# EAGLE design CU (EAGLE 6.5.0)
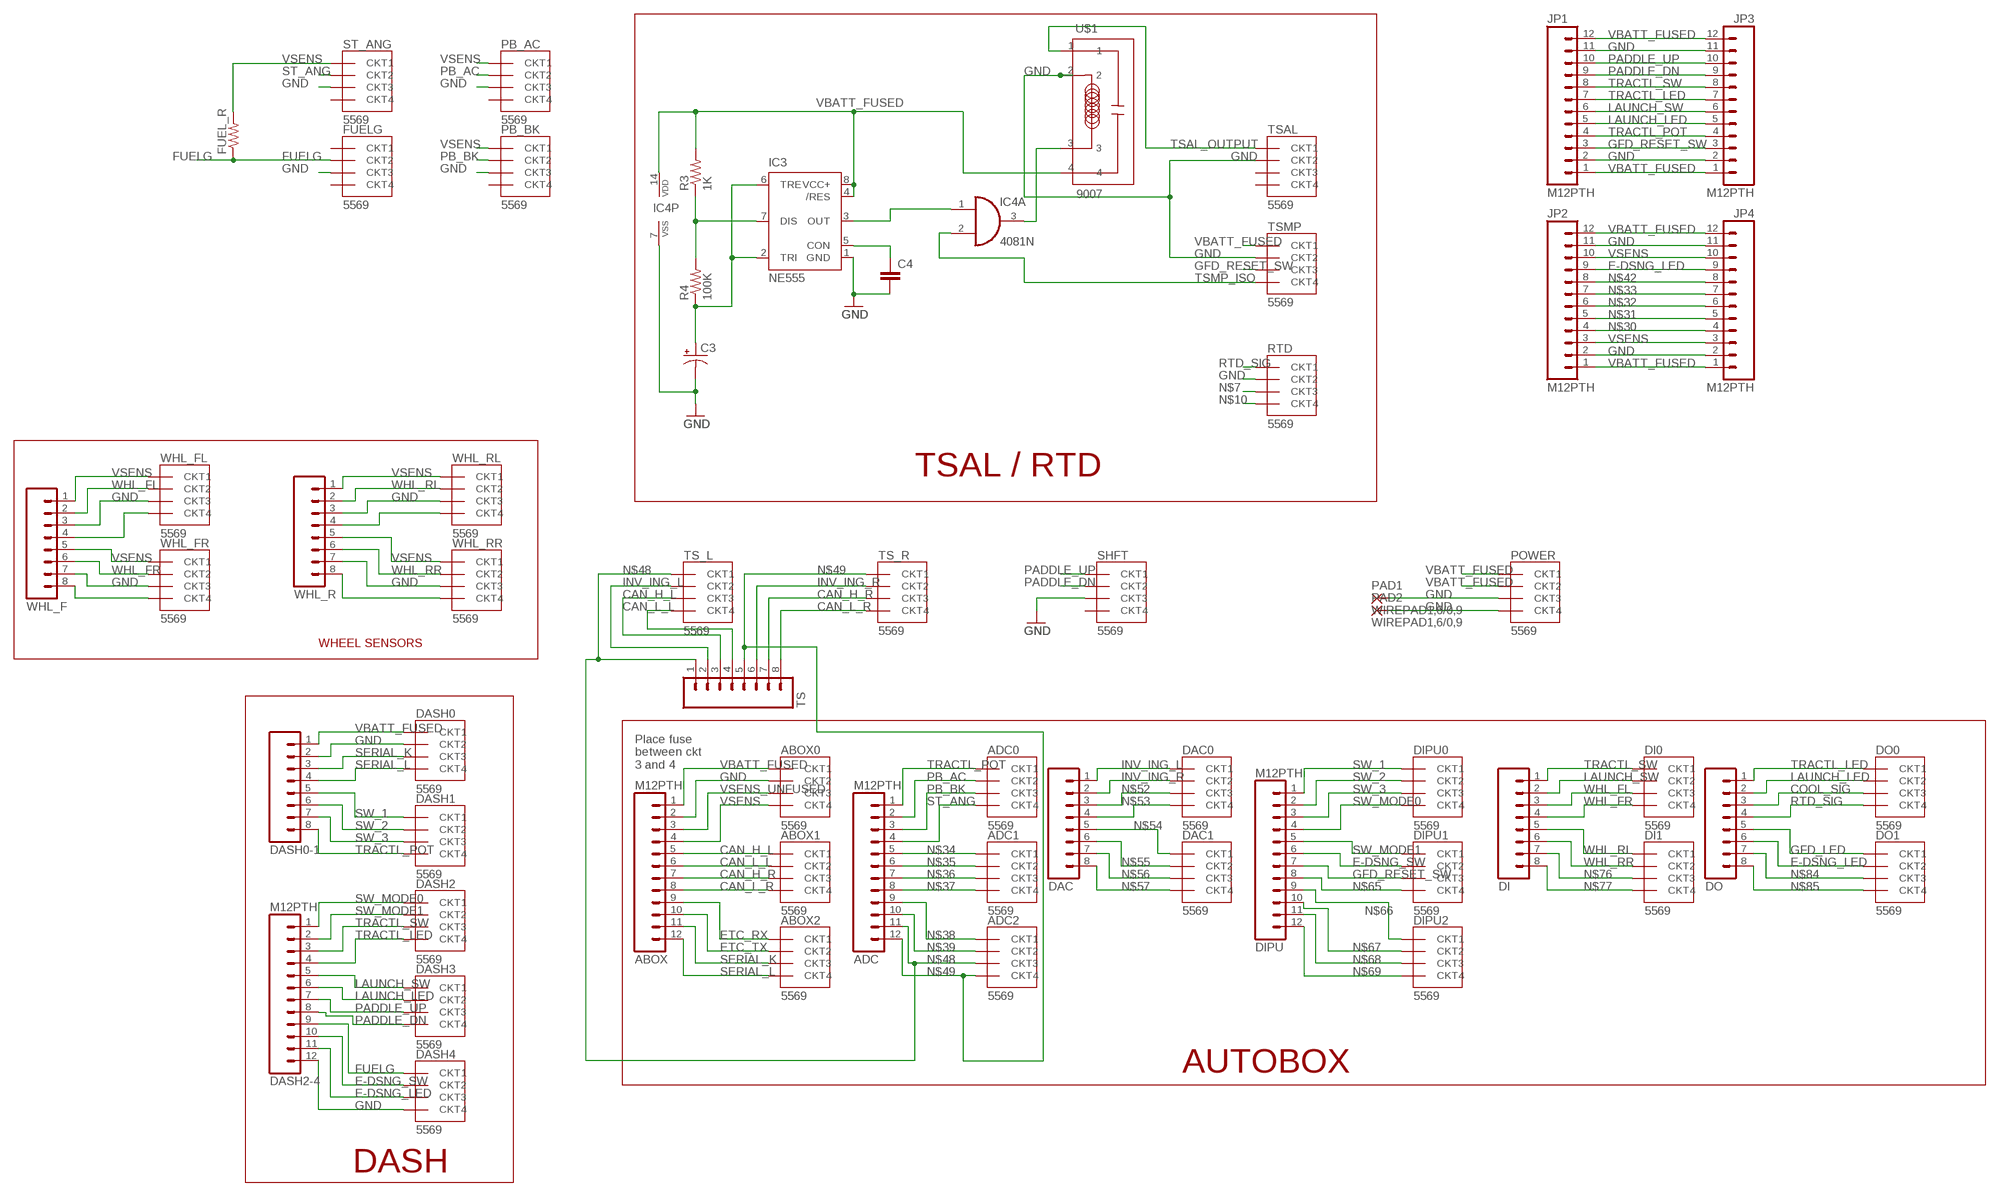
[diagram p0: schematic, sheet 1]

## Parts
ABOX  M12PTH  [1X12]
ABOX0  5569  [5569]
ABOX1  5569  [5569]
ABOX2  5569  [5569]
ADC  M12PTH  [1X12]
ADC0  5569  [5569]
ADC1  5569  [5569]
ADC2  5569  [5569]
C3  CAP_POLPTH1  [CPOL-RADIAL-100UF-25V]
C4  CAPPTH2  [CAP-PTH-SMALL2]
DAC  M081X08  [1X08]
DAC0  5569  [5569]
DAC1  5569  [5569]
DASH0  5569  [5569]
DASH0-1  M081X08  [1X08]
DASH1  5569  [5569]
DASH2  5569  [5569]
DASH2-4  M12PTH  [1X12]
DASH3  5569  [5569]
DASH4  5569  [5569]
DI  M081X08  [1X08]
DI0  5569  [5569]
DI1  5569  [5569]
DIPU  M12PTH  [1X12]
DIPU0  5569  [5569]
DIPU1  5569  [5569]
DIPU2  5569  [5569]
DO  M081X08  [1X08]
DO0  5569  [5569]
DO1  5569  [5569]
FUEL_R  R-US_0204/7  [0204/7]
FUELG  5569  [5569]
IC3  NE555  [DIL-08]
IC4  4081N  [DIL14]
JP1  M12PTH  [1X12]
JP2  M12PTH  [1X12]
JP3  M12PTH  [1X12]
JP4  M12PTH  [1X12]
PAD1  WIREPAD1,6/0,9  [1,6/0,9]
PAD2  WIREPAD1,6/0,9  [1,6/0,9]
PB_AC  5569  [5569]
PB_BK  5569  [5569]
POWER  5569  [5569]
R3  1K  RESISTOREZ  [AXIAL-0.3EZ]
R4  100K  RESISTOREZ  [AXIAL-0.3EZ]
RTD  5569  [5569]
SHFT  5569  [5569]
ST_ANG  5569  [5569]
TS  M081X08  [1X08]
TS_L  5569  [5569]
TS_R  5569  [5569]
TSAL  5569  [5569]
TSMP  5569  [5569]
U$1  9007  [9007]
WHL_F  M081X08  [1X08]
WHL_FL  5569  [5569]
WHL_FR  5569  [5569]
WHL_R  M081X08  [1X08]
WHL_RL  5569  [5569]
WHL_RR  5569  [5569]

## Nets
CAN_H_L: ABOX1.CKT1 ABOX.5 TS.3 TS_L.CKT3
CAN_H_R: ABOX1.CKT3 ABOX.7 TS.7 TS_R.CKT3
CAN_L_L: ABOX1.CKT2 ABOX.6 TS.4 TS_L.CKT4
CAN_L_R: ABOX1.CKT4 ABOX.8 TS.8 TS_R.CKT4
COOL_SIG: DO0.CKT3 DO.3
E-DSNG_LED: DASH2-4.11 DASH4.CKT3 DO1.CKT2 DO.6 JP2.9 JP4.9
E-DSNG_SW: DASH2-4.10 DASH4.CKT2 DIPU1.CKT2 DIPU.6
ETC_RX: ABOX2.CKT1 ABOX.9
ETC_TX: ABOX2.CKT2 ABOX.10
FUELG: DASH2-4.9 DASH4.CKT1 FUEL_R.1 FUELG.CKT2
GFD_LED: DO1.CKT1 DO.5
GFD_RESET_SW: DIPU1.CKT3 DIPU.7 JP1.3 JP3.3 TSMP.CKT3
GND: ABOX0.CKT2 ABOX.2 C3.2(-) C4.2 DASH0-1.2 DASH0.CKT2 DASH2-4.12 DASH4.CKT4 FUELG.CKT3 IC3.1(GND) IC4.7(P:VSS) JP1.2 JP1.11 JP2.2 JP2.11 JP3.2 JP3.11 JP4.2 JP4.11 PAD1.1(P) PAD2.1(P) PB_AC.CKT3 PB_BK.CKT3 POWER.CKT3 POWER.CKT4 RTD.CKT2 SHFT.CKT3 ST_ANG.CKT3 TSAL.CKT2 TSMP.CKT2 U$1.2 WHL_F.3 WHL_F.7 WHL_FL.CKT3 WHL_FR.CKT3 WHL_R.3 WHL_R.7 WHL_RL.CKT3 WHL_RR.CKT3
INV_ING_L: DAC0.CKT1 DAC.1 TS.2 TS_L.CKT2
INV_ING_R: DAC0.CKT2 DAC.2 TS.6 TS_R.CKT2
LAUNCH_LED: DASH2-4.6 DASH3.CKT2 DO0.CKT2 DO.2 JP1.5 JP3.5
LAUNCH_SW: DASH2-4.5 DASH3.CKT1 DI0.CKT2 DI.2 JP1.6 JP3.6
N$4: WHL_F.4 WHL_FL.CKT4
N$7: RTD.CKT3
N$8: WHL_F.8 WHL_FR.CKT4
N$9: WHL_R.8 WHL_RR.CKT4
N$10: RTD.CKT4
N$12: IC3.3(OUT) IC4.1(A:I0)
N$13: WHL_R.4 WHL_RL.CKT4
N$14: IC4.3(A:O) U$1.3
N$22: IC3.7(DIS) R3.P$1 R4.P$2
N$23: C3.1(+) IC3.2(TRI) IC3.6(TRE) R4.P$1
N$24: C4.1 IC3.5(CON)
N$30: JP2.4 JP4.4
N$31: JP2.5 JP4.5
N$32: JP2.6 JP4.6
N$33: JP2.7 JP4.7
N$34: ADC1.CKT1 ADC.5
N$35: ADC1.CKT2 ADC.6
N$36: ADC1.CKT3 ADC.7
N$37: ADC1.CKT4 ADC.8
N$38: ADC2.CKT1 ADC.9
N$39: ADC2.CKT2 ADC.10
N$42: JP2.8 JP4.8
N$48: ADC2.CKT3 ADC.11 TS.1 TS_L.CKT1
N$49: ADC2.CKT4 ADC.12 TS.5 TS_R.CKT1
N$52: DAC0.CKT3 DAC.3
N$53: DAC0.CKT4 DAC.4
N$54: DAC1.CKT1 DAC.5
N$55: DAC1.CKT2 DAC.6
N$56: DAC1.CKT3 DAC.7
N$57: DAC1.CKT4 DAC.8
N$65: DIPU1.CKT4 DIPU.8
N$66: DIPU2.CKT1 DIPU.9
N$67: DIPU2.CKT2 DIPU.10
N$68: DIPU2.CKT3 DIPU.11
N$69: DIPU2.CKT4 DIPU.12
N$76: DI1.CKT3 DI.7
N$77: DI1.CKT4 DI.8
N$84: DO1.CKT3 DO.7
N$85: DO1.CKT4 DO.8
PADDLE_DN: DASH2-4.8 DASH3.CKT4 JP1.9 JP3.9 SHFT.CKT2
PADDLE_UP: DASH2-4.7 DASH3.CKT3 JP1.10 JP3.10 SHFT.CKT1
PB_AC: ADC0.CKT2 ADC.2 PB_AC.CKT2
PB_BK: ADC0.CKT3 ADC.3 PB_BK.CKT2
RTD_SIG: DO0.CKT4 DO.4 RTD.CKT1
SERIAL_K: ABOX2.CKT3 ABOX.11 DASH0-1.3 DASH0.CKT3
SERIAL_L: ABOX2.CKT4 ABOX.12 DASH0-1.4 DASH0.CKT4
ST_ANG: ADC0.CKT4 ADC.4 ST_ANG.CKT2
SW_1: DASH0-1.5 DASH1.CKT1 DIPU0.CKT1 DIPU.1
SW_2: DASH0-1.6 DASH1.CKT2 DIPU0.CKT2 DIPU.2
SW_3: DASH0-1.7 DASH1.CKT3 DIPU0.CKT3 DIPU.3
SW_MODE0: DASH2-4.1 DASH2.CKT1 DIPU0.CKT4 DIPU.4
SW_MODE1: DASH2-4.2 DASH2.CKT2 DIPU1.CKT1 DIPU.5
TRACTL_LED: DASH2-4.4 DASH2.CKT4 DO0.CKT1 DO.1 JP1.7 JP3.7
TRACTL_POT: ADC0.CKT1 ADC.1 DASH0-1.8 DASH1.CKT4 JP1.4 JP3.4
TRACTL_SW: DASH2-4.3 DASH2.CKT3 DI0.CKT1 DI.1 JP1.8 JP3.8
TSAL_OUTPUT: TSAL.CKT1 U$1.1
TSMP_ISO: IC4.2(A:I1) TSMP.CKT4
VBATT_FUSED: ABOX0.CKT1 ABOX.1 DASH0-1.1 DASH0.CKT1 IC3.4(/RES) IC3.8(VCC+) IC4.14(P:VDD) JP1.1 JP1.12 JP2.1 JP2.12 JP3.1 JP3.12 JP4.1 JP4.12 POWER.CKT1 POWER.CKT2 R3.P$2 TSMP.CKT1 U$1.4
VSENS: ABOX0.CKT4 ABOX.4 FUEL_R.2 JP2.3 JP2.10 JP4.3 JP4.10 PB_AC.CKT1 PB_BK.CKT1 ST_ANG.CKT1 WHL_F.1 WHL_F.5 WHL_FL.CKT1 WHL_FR.CKT1 WHL_R.1 WHL_R.5 WHL_RL.CKT1 WHL_RR.CKT1
VSENS_UNFUSED: ABOX0.CKT3 ABOX.3
WHL_FL: DI0.CKT3 DI.3 WHL_F.2 WHL_FL.CKT2
WHL_FR: DI0.CKT4 DI.4 WHL_F.6 WHL_FR.CKT2
WHL_RL: DI1.CKT1 DI.5 WHL_R.2 WHL_RL.CKT2
WHL_RR: DI1.CKT2 DI.6 WHL_R.6 WHL_RR.CKT2
Unconnected: FUELG.CKT1 FUELG.CKT4 IC4.4(B:O) IC4.5(B:I0) IC4.6(B:I1) IC4.8(C:I0) IC4.9(C:I1) IC4.10(C:O) IC4.11(D:O) IC4.12(D:I0) IC4.13(D:I1) PB_AC.CKT4 PB_BK.CKT4 SHFT.CKT4 ST_ANG.CKT4 TSAL.CKT3 TSAL.CKT4

## Notes on the sheet
- TSAL / RTD
- WHEEL SENSORS
- Place fuse 
  between ckt
  3 and 4
- AUTOBOX
- DASH

## Library data of the parts
ABOX ADC DASH2-4 DIPU JP1-JP4 = SparkFun-Connectors:M12: Header 12 Standard 12-pin 0.1" header. Use with straight break away headers (SKU : PRT-00116), right angle break away headers (PRT-00553), swiss pins (PRT-00743), machine pins (PRT-00117), and female headers (PRT-00115).
ABOX0 ABOX1 ABOX2 ADC0 ADC1 ADC2 DAC0 DAC1 DASH0 DASH1-DASH4 DI0 DI1 DIPU0 DIPU1 DIPU2 DO0 DO1 FUELG PB_AC PB_BK POWER RTD SHFT ST_ANG TS_L TS_R TSAL TSMP WHL_FL WHL_FR WHL_RL WHL_RR = Molex connectors:5569
C3 = SparkFun-Capacitors:CAP_POL: Capacitor Polarized These are standard SMD and PTH capacitors. Normally 10uF, 47uF, and 100uF in electrolytic and tantalum varieties. Always verify the external diameter of the through hole cap, it varies with capacity, voltage, and manufacturer. The EIA devices should be standard.
C4 = SparkFun-Passives:CAP: Capacitor Standard 0603 ceramic capacitor, and 0.1" leaded capacitor.
DAC DASH0-1 DI DO TS WHL_F WHL_R = SparkFun-Connectors:M08: Header 8 Standard 8-pin 0.1" header. Use with straight break away headers (SKU : PRT-00116), right angle break away headers (PRT-00553), swiss pins (PRT-00743), machine pins (PRT-00117), and female headers (PRT-00115).
FUEL_R = resistor:R-US_: RESISTOR, American symbol
IC3 = st-microelectronics:NE555: General purpose bipolar Timer; MF: Arrow Electronics; MPN: NE555N; OC_FARNELL: 1467742; OC_NEWARK: 89K1486
IC4 = 40xx:4081: Quad 2-input AND
PAD1 PAD2 = wirepad:WIREPAD: Wire PAD connect wire on PCB
R3 R4 = SparkFun-Passives:RESISTOR: Resistor Basic schematic elements and footprints for 0603, 1206, and PTH resistors.
U$1 = MHR14:9007

## Board
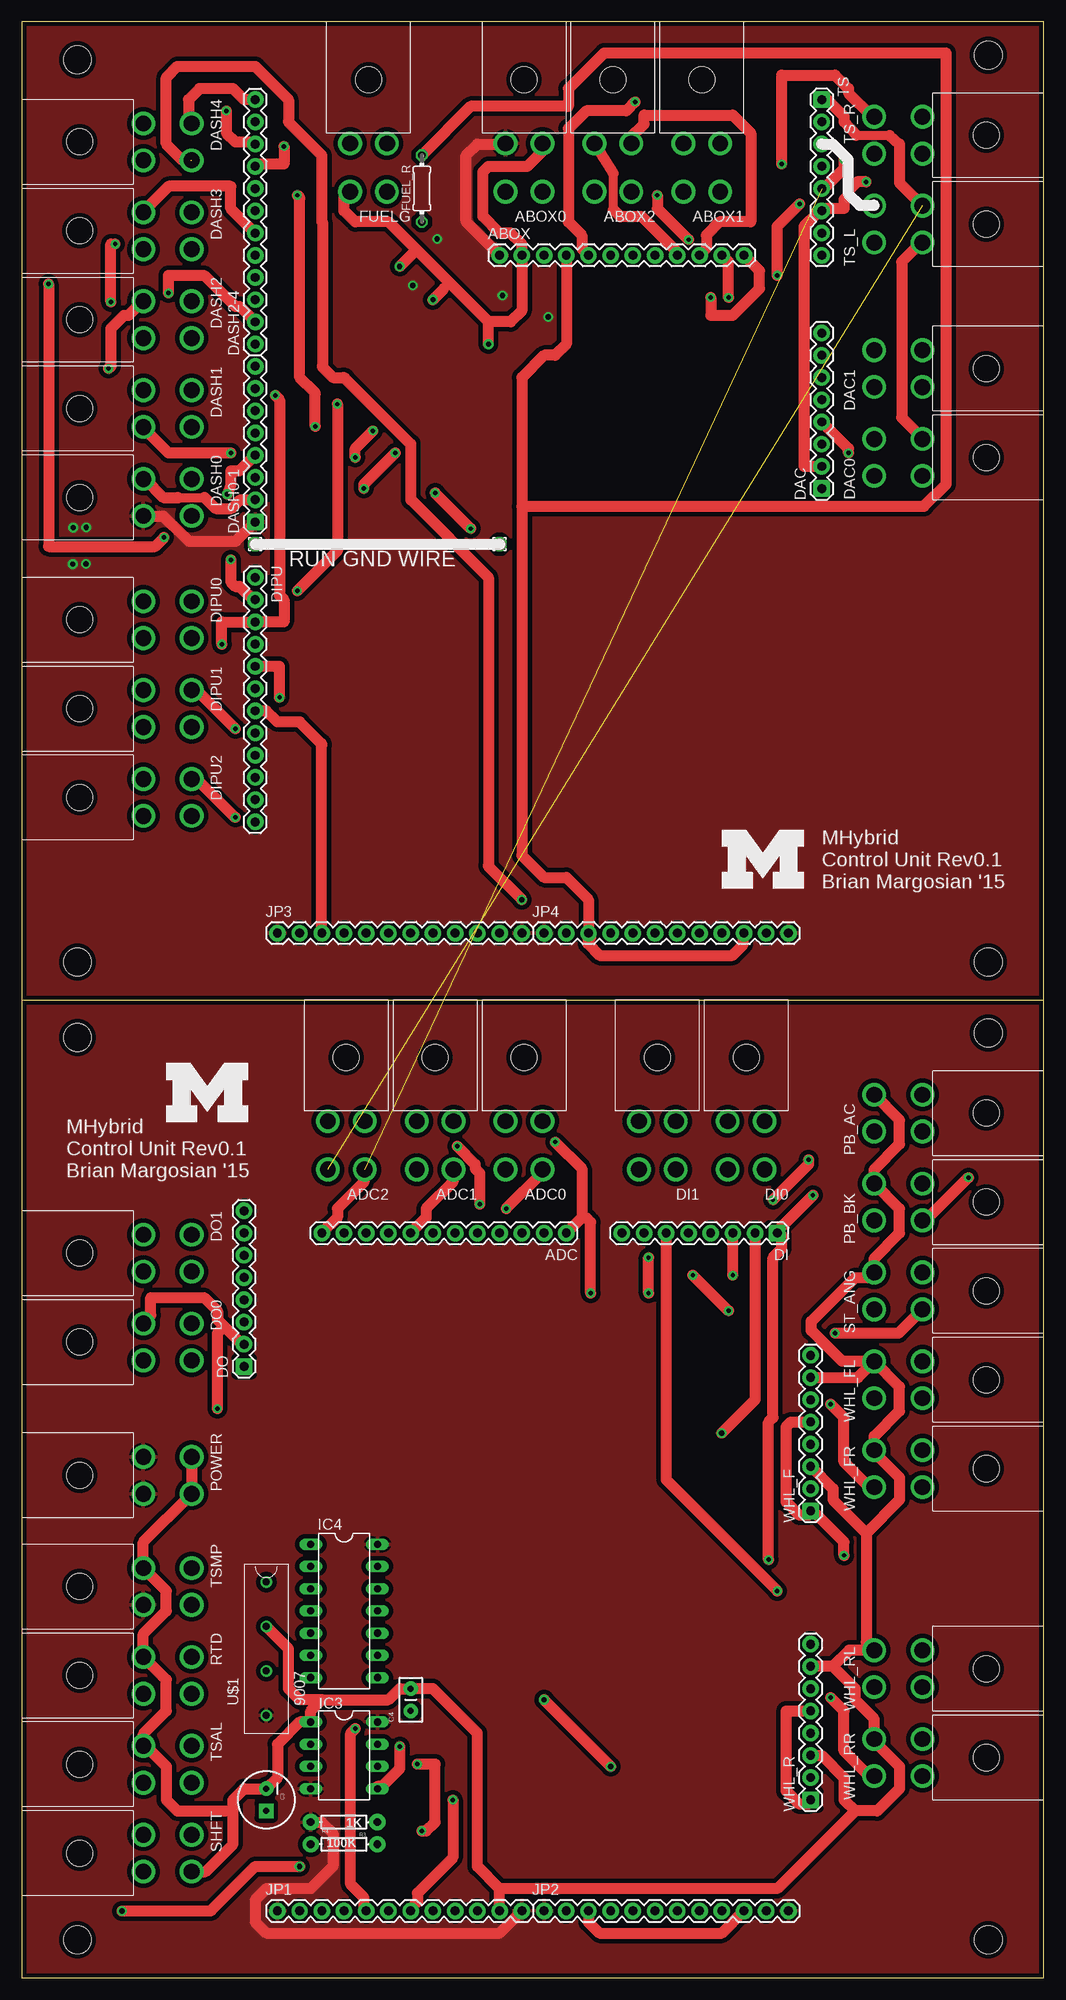
[diagram p1: board, top side]
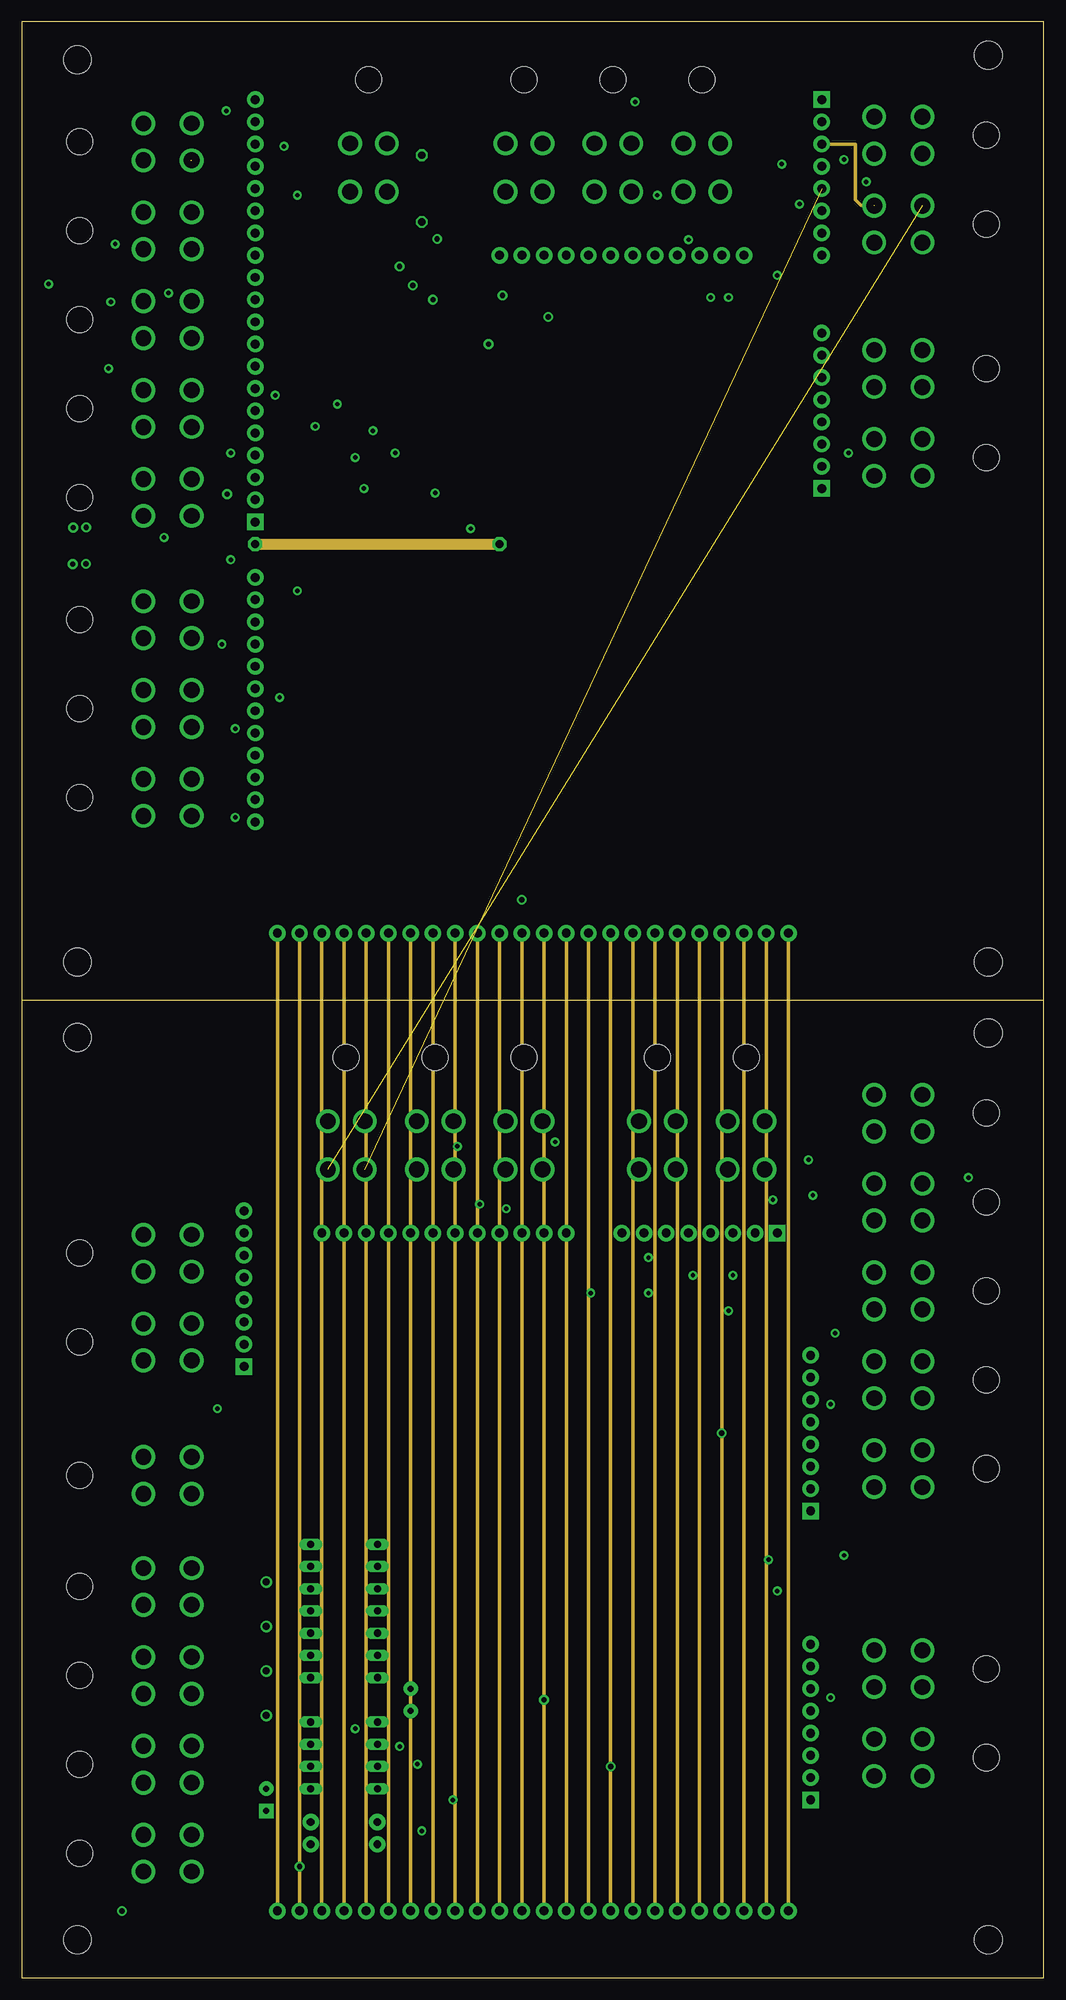
[diagram p2: board, inner layer Route2]
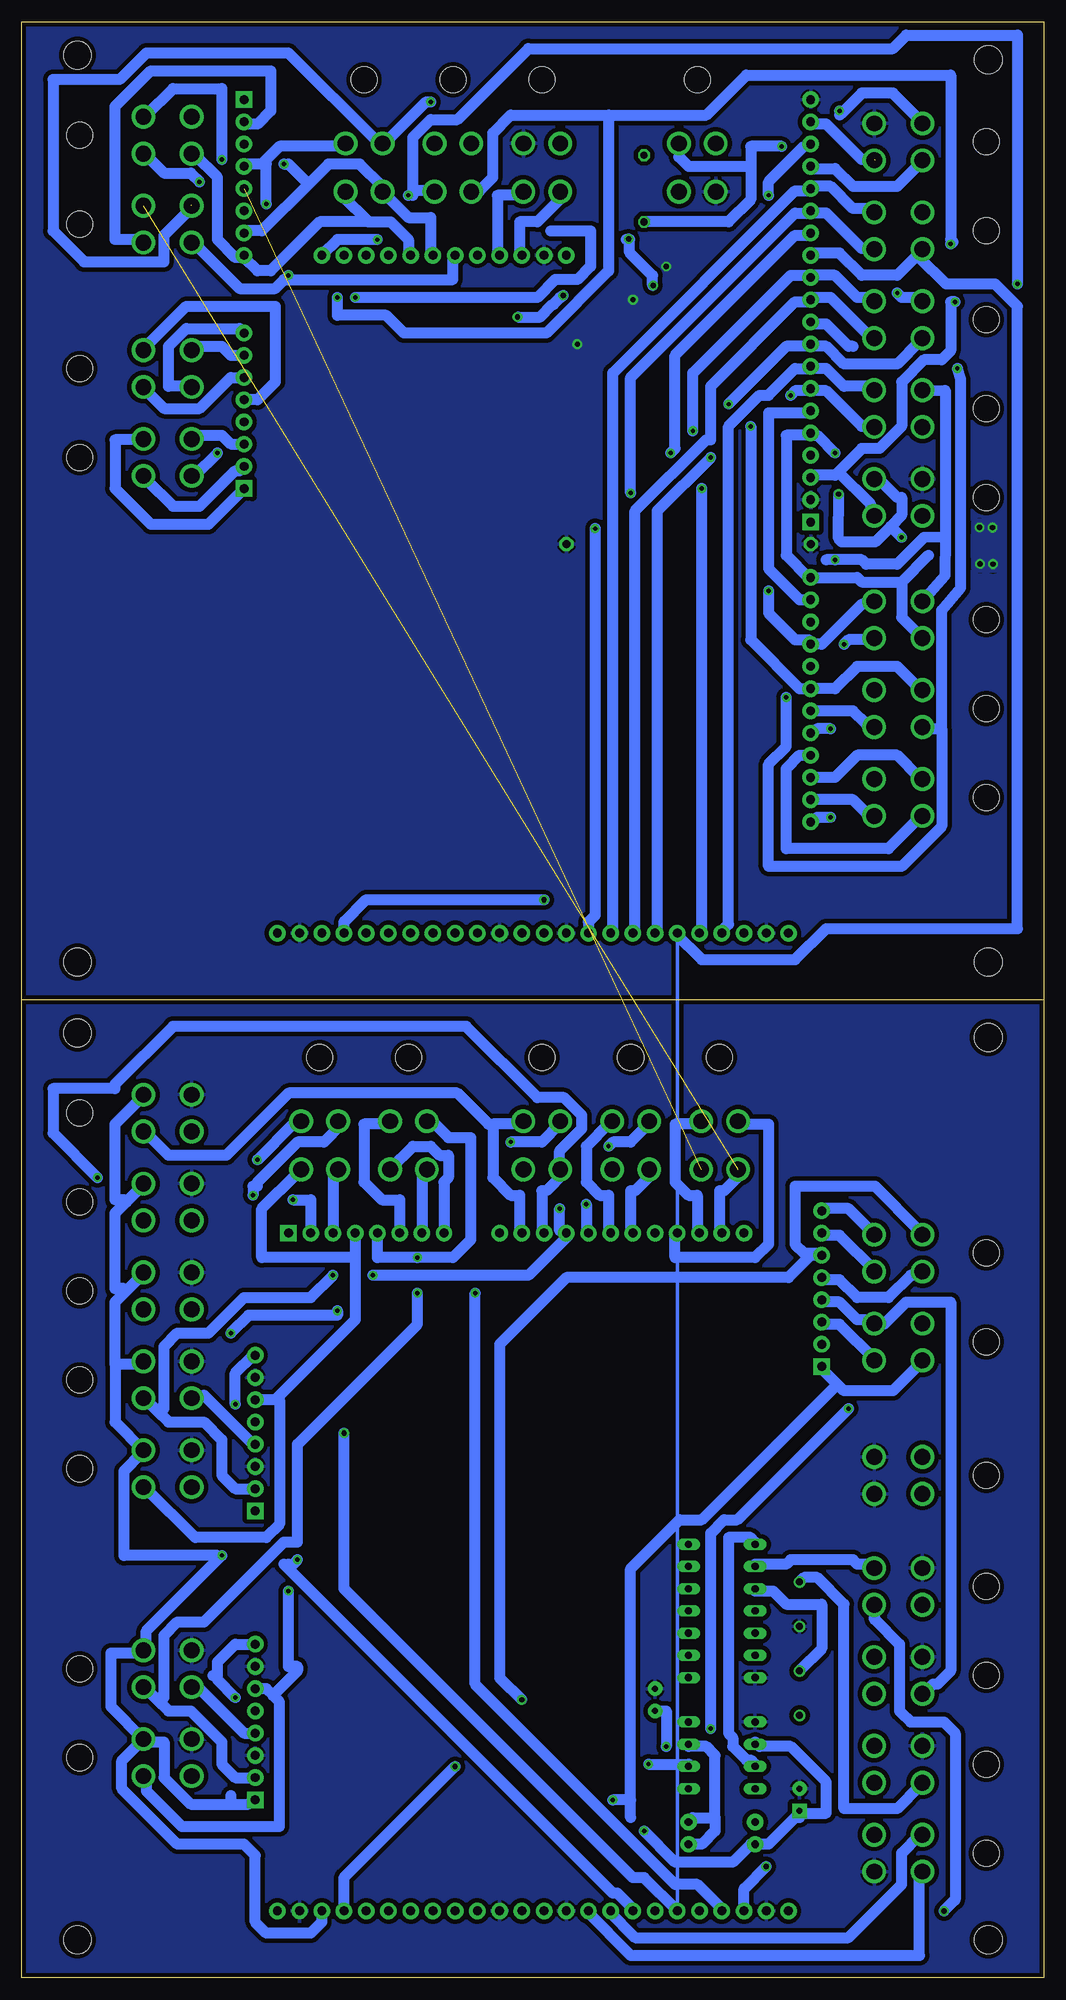
[diagram p3: board, bottom side, seen from below]

Size 116.84 x 223.52 mm. Coordinates in mm from the lower left corner, seen from the top.
Outline: 116.84,111.76 116.84,0 0,0 0,111.76
Outline: 0,111.76 116.84,111.76
Outline: 116.84,111.76 116.84,223.52 0,223.52 0,111.76
Copper layers (1+2+16): Top 0.0178mm / dielectric 12mil / Route2 0.0356mm / dielectric 28mil / Bottom 0.0178mm
Design rules "AVC-2Lyr *": minimum track width 50mil, minimum drill 20mil, track to track 20mil, track to pad 10mil, pad to pad 10mil, via to via 6mil, smd to smd 6mil, copper to edge 20mil, drill to drill 16mil, minimum pad ring 10mil, minimum via ring 10mil, stop-mask expansion 3mil, vias tented up to drill 0mil, thermal gap 10mil
Holes 3.2 mm at 6.35,4.32 6.35,107.44 110.49,107.95 110.49,4.32 6.35,116.08 6.35,219.2 110.49,219.71 110.49,116.08

### Footprints (pad centres in the part's own frame; a part is rotated, then mirrored left to right if it is on the bottom)
1X12 = drill 1.016 pad 1.88: 1 0,0; 2 2.54,0; 3 5.08,0; 4 7.62,0; 5 10.16,0; 6 12.7,0; 7 15.24,0; 8 17.78,0; 9 20.32,0; 10 22.86,0; 11 25.4,0; 12 27.94,0
5569 = drill 1.803: CKT1 6.934,13.894; CKT2 2.718,13.894; CKT3 6.934,19.406; CKT4 2.718,19.406 | hole 2.997: 4.826,6.604
CPOL-RADIAL-100UF-25V = drill 0.7 pad 1.651 square: 1 1.27,0 | drill 0.7 pad 1.651: 2 -1.27,0
CAP-PTH-SMALL2 = drill 0.7 pad 1.651: 1 0,0; 2 2.54,0
1X08 = drill 1.016 pad 1.88 square: 1 0,0 | drill 1.016 pad 1.88: 2 2.54,0; 3 5.08,0; 4 7.62,0; 5 10.16,0; 6 12.7,0; 7 15.24,0; 8 17.78,0
0204/7 = drill 0.813 octagon: 1 -3.81,0; 2 3.81,0
DIL-08 = drill 0.813 long: 1 -3.81,-3.81; 2 -1.27,-3.81; 3 1.27,-3.81; 4 3.81,-3.81; 5 3.81,3.81; 6 1.27,3.81; 7 -1.27,3.81; 8 -3.81,3.81
DIL14 = drill 0.813 long: 1 -7.62,-3.81; 2 -5.08,-3.81; 3 -2.54,-3.81; 4 0,-3.81; 5 2.54,-3.81; 6 5.08,-3.81; 7 7.62,-3.81; 8 7.62,3.81; 9 5.08,3.81; 10 2.54,3.81; 11 0,3.81; 12 -2.54,3.81; 13 -5.08,3.81; 14 -7.62,3.81
1,6/0,9 = drill 0.914 pad 1.6 octagon: 1 0,0
AXIAL-0.3EZ = drill 0.9 pad 1.88: P$1 -3.81,0; P$2 3.81,0
9007 = drill 0.8: 1 2.54,17.272; 2 2.54,12.192; 3 2.54,7.112; 4 2.54,2.032

### Placement (x,y rotation side)
ABOX  54.61,196.85 0 top
ABOX0  62.23,223.52 180 top
ABOX1  82.55,223.52 180 top
ABOX2  72.39,223.52 180 top
ADC  62.23,85.09 180 top
ADC0  62.23,111.76 180 top
ADC1  52.07,111.76 180 top
ADC2  41.91,111.76 180 top
C3  27.94,20.32 270 top
C4  44.45,30.48 90 top
DAC  91.44,170.18 90 top
DAC0  116.84,168.91 90 top
DAC1  116.84,179.07 90 top
DASH0  0,173.99 270 top
DASH0-1  26.67,166.37 90 top
DASH1  0,184.15 270 top
DASH2  0,194.31 270 top
DASH2-4  26.67,186.69 90 top
DASH3  0,204.47 270 top
DASH4  0,214.63 270 top
DI  86.36,85.09 180 top
DI0  87.63,111.76 180 top
DI1  77.47,111.76 180 top
DIPU  26.67,160.02 270 top
DIPU0  0,160.02 270 top
DIPU1  0,149.86 270 top
DIPU2  0,139.7 270 top
DO  25.4,69.85 90 top
DO0  0,77.47 270 top
DO1  0,87.63 270 top
FUEL_R  45.72,204.47 90 top
FUELG  44.45,223.52 180 top
IC3  36.83,25.4 270 top
IC4  36.83,41.91 270 top
JP1  29.21,7.62 0 top
JP2  59.69,7.62 0 top
JP3  29.21,119.38 0 top
JP4  59.69,119.38 0 top
PAD1  26.67,163.83 0 top
PAD2  54.61,163.83 0 top
PB_AC  116.84,93.98 90 top
PB_BK  116.84,83.82 90 top
POWER  0,62.23 270 top
R3  36.83,17.78 180 top
R4  36.83,15.24 0 top
RTD  0,39.37 270 top
SHFT  0,19.05 270 top
ST_ANG  116.84,73.66 90 top
TS  91.44,214.63 270 top
TS_L  116.84,195.58 90 top
TS_R  116.84,205.74 90 top
TSAL  0,29.21 270 top
TSMP  0,49.53 270 top
U$1  25.4,27.94 0 top
U$2  [BLOCKM]  16.51,97.79 0 top
U$3  [BLOCKM]  80.01,124.46 0 top
WHL_F  90.17,53.34 90 top
WHL_FL  116.84,63.5 90 top
WHL_FR  116.84,53.34 90 top
WHL_R  90.17,20.32 90 top
WHL_RL  116.84,30.48 90 top
WHL_RR  116.84,20.32 90 top

### Tracks (layer width: path | path; a pad name or v marks a point on that pad's centre or on a via)
CAN_H_L  (via drill 0.51)  (1 unrouted)
  Top 1.27: ABOX.5 64.01,197.61 64.01,199.14 62.48,200.66 62.48,211.33 64.52,213.36 69.09,213.36 v70.1,214.38
  Route2 0.406: 97.46,202.56 95.89,202.56 95.25,203.2 95.25,209.55 TS.3
  Bottom 1.27: v70.1,214.38 70.61,214.38 75.18,209.8 ABOX1.CKT1 76.2,209.8 86.36,219.96 102.62,219.96 105.66,216.92 113.28,216.92 113.28,199.64 109.73,196.09 100.58,196.09 100.58,199.14 97.54,202.18 TS_L.CKT3
CAN_H_R  (via drill 0.51)
  Top 1.27: v86.87,207.26 86.87,217.42 92.96,217.42 94.49,215.9 94.49,215.39 97.03,212.85 TS_R.CKT3
  Bottom 1.27: ABOX.7 70.1,197.1 70.1,201.17 72.64,201.17 75.18,203.71 ABOX1.CKT3 75.69,204.72 78.23,207.26 81.79,207.26 84.07,204.98 | 84.07,204.98 89.41,199.64 91.44,199.64 TS.7 | 84.07,204.98 86.36,207.26 v86.87,207.26
CAN_L_L  (via drill 0.51)
  Top 1.27: v88.9,202.69 86.36,200.15 v86.36,194.56
  Bottom 1.27: 89.41,207.26 91.44,207.26 TS.4 | 89.41,207.26 87.38,209.3 80.26,209.3 ABOX1.CKT2 | 86.36,194.06 86.87,194.06 87.88,193.04 91.95,193.04 97.03,198.12 TS_L.CKT4 | 86.36,194.06 67.56,194.06 67.56,196.6 ABOX.6 | 89.41,207.26 88.9,207.26 v88.9,202.69 | v86.36,194.56 86.36,194.06
CAN_L_R
  Bottom 1.27: 77.22,200.66 74.68,200.66 72.64,198.63 72.64,197.1 ABOX.8 | 77.22,200.66 80.26,203.71 ABOX1.CKT4 | 77.22,200.66 82.8,200.66 88.39,195.07 89.92,195.07 91.44,196.6 TS.8 91.95,196.6 92.46,196.6 94.49,198.63 94.49,205.74 97.03,208.28 TS_R.CKT4
COOL_SIG
  Bottom 1.27: DO.3 25.4,74.68 23.37,74.68 19.3,70.61 DO0.CKT3
E-DSNG_LED  (via drill 0.6)  (1 unrouted)
  Top 1.27: 19.28,207.7 18.47,207.7 arc-45 18.29,207.77 16.51,209.55 16.51,217.06 arc-45 16.58,217.24 17.78,218.44 26.57,218.44 arc-45 26.74,218.37 30.48,214.63 30.48,212.19 arc45 30.55,212.02 34.29,208.28 34.29,200.76 arc45 34.36,200.59 34.36,184.18 arc45 34.44,184 35.56,182.88 36.73,182.88 arc-45 36.9,182.81 44.45,175.26 44.45,169.01 arc45 44.52,168.84 53.34,160.02 53.34,127.11 arc45 53.41,126.93 v57.15,123.19 | v59.69,31.75 v67.31,24.13
  Route2 0.406: JP4.9 JP2.9
  Bottom 1.27: DASH2-4.11 26.42,211.84 24.89,211.84 20.83,207.77 19.81,207.77 DASH4.CKT3 | DO1.CKT2 14.22,85.34 19.3,90.42 28.45,90.42 28.45,83.82 27.43,82.8 25.4,82.8 DO.6 26.57,82.55 arc-45 26.74,82.48 29.21,80.01 54.51,80.01 arc-45 54.68,79.94 62.23,72.39 62.23,34.4 arc-45 62.16,34.22 v59.69,31.75 | JP4.9 80.01,120.55 arc45 79.94,120.72 77.47,123.19 v57.15,123.19 | JP2.9 80.01,11.32 arc45 79.94,11.5 v67.31,24.13
E-DSNG_SW  (via drill 0.51)
  Top 1.27: v23.37,213.36 23.37,210.82 24.38,209.8 26.42,209.8 DASH2-4.10 | v33.53,177.29 33.53,181 arc45 33.45,181.18 31.75,182.88 31.75,203.35 arc45 31.68,203.53 v31.5,203.71
  Bottom 1.27: DIPU1.CKT2 14.22,147.32 16.76,149.86 21.34,149.86 23.88,147.32 DIPU.6 27.94,147.32 33.53,152.91 v33.53,177.29 | 23.11,213.11 20.83,215.39 17.27,215.39 14.22,212.34 DASH4.CKT2 | 23.11,213.11 23.37,212.85 | DASH2-4.10 26.92,209.3 27.43,209.3 31.5,205.23 v31.5,203.71 | v23.37,213.36 23.11,213.11
ETC_RX
  Top 1.016: 67.61,202.03 67.61,206.2
  Top 1.27: ABOX.9 74.93,197.21 70.89,201.24 68.4,201.24 67.61,202.03 | 67.61,206.2 ABOX2.CKT1
ETC_TX
  Top 1.27: ABOX.10 78.23,197.61 78.23,199.14 79.76,200.66 83.31,200.66 83.31,210.82 81.28,212.85 71.12,212.85 71.12,211.84 69.6,210.31 69.6,209.8 ABOX2.CKT2
FUELG  (via drill 0.51)
  Top 1.27: v29.97,209.3 29.97,207.26 26.92,207.26 DASH2-4.9
  Bottom 1.27: FUEL_R.1 36.07,200.66 33.53,203.2 33.53,207.01 | 33.53,207.01 33.53,209.3 v29.97,209.3 | DASH4.CKT1 14.22,207.26 16.76,204.72 21.84,204.72 23.88,206.76 26.42,206.76 DASH2-4.9 | FUELG.CKT2 41.73,208.1 40.64,207.01 33.53,207.01
GFD_LED
  Bottom 1.27: DO.5 25.4,79.76 23.37,79.76 21.34,77.72 17.78,77.72 15.24,80.26 14.22,80.26 DO1.CKT1
GFD_RESET_SW  (via drill 0.6)
  Top 1.27: JP3.3 34.29,140.87 arc45 34.22,141.04 31.75,143.51 29.32,143.51 arc-45 29.14,143.58 27.94,144.78 DIPU.7 | v11.43,7.62 21.48,7.62 arc45 21.66,7.69 26.67,12.7 v31.75,12.7
  Route2 0.406: JP3.3 JP1.3
  Bottom 1.27: DIPU.7 21.84,144.78 20.32,143.26 19.81,143.26 DIPU1.CKT3 | TSMP.CKT3 19.41,41.1 arc-45 19.33,40.92 16.51,38.1 16.51,30.59 arc-45 16.44,30.41 15.24,29.21 11.54,29.21 arc45 11.36,29.14 10.16,27.94 10.16,8.99 arc45 10.23,8.82 v11.43,7.62 | JP1.3 34.29,10.05 arc45 34.22,10.23 v31.75,12.7
GND  (via drill 0.6)
  Top 1.016: 17.88,169.14 20.85,169.14
  Top 1.27: SHFT.CKT3 21.01,12.12 24.13,15.24 24.13,19.05 | 24.13,19.05 24.13,20.32 25.4,21.59 C3.2 29.21,22.86 29.21,26.67 31.75,29.21 IC3.1 33.02,30.48 34.29,31.75 | 34.29,31.75 41.91,31.75 43.18,33.02 C4.2 46.99,33.02 52.07,27.94 52.07,12.7 54.61,10.16 | 95.25,19.05 97.79,19.05 100.33,21.59 100.33,24.13 97.43,27.03 WHL_RR.CKT3 97.43,29.57 95.25,31.75 95.25,33.02 92.71,35.56 | 92.71,35.56 94.56,37.41 WHL_RL.CKT3 96.52,38.33 96.52,50.8 | 92.71,35.56 WHL_R.7 | JP1.11 54.61,10.16 | WHL_R.3 91.44,25.4 93.98,22.86 93.98,20.32 95.25,19.05 | 95.25,19.05 86.36,10.16 54.61,10.16 | WHL_F.3 92.71,55.88 92.71,54.61 96.52,50.8 | 96.52,50.8 100.33,54.61 100.33,57.15 97.43,60.05 WHL_FR.CKT3 97.43,61.87 100.33,64.77 100.33,67.54 WHL_FL.CKT3 | WHL_F.7 95.58,68.58 WHL_FL.CKT3 | PB_AC.CKT3 100.33,98.02 100.33,95.25 97.43,92.35 PB_BK.CKT3 100.33,87.86 100.33,85.09 97.43,82.19 ST_ANG.CKT3 96.85,80.01 95.25,80.01 90.25,75.01 90.25,73.97 93.78,70.43 WHL_FL.CKT3 | 34.29,31.75 31.75,31.75 30.48,33.02 30.48,37.59 U$1.2 | POWER.CKT4 POWER.CKT3 13.89,49.78 TSMP.CKT2 16.51,44.2 16.51,41.91 13.89,39.29 RTD.CKT2 16.51,34.04 16.51,30.48 13.89,27.86 TSAL.CKT2 14.15,26.49 16.51,24.13 16.51,20.32 17.78,19.05 24.13,19.05 | DASH2-4.12 25.4,214.63 24.13,215.9 20.32,215.9 19.05,214.63 19.05,212.27 DASH4.CKT4 | ABOX0.CKT2 59.51,208.74 57.78,207.01 53.34,207.01 52.7,206.38 52.7,201.29 54.61,199.39 55.88,199.39 57.15,198.12 ABOX.2 57.15,190.5 55.88,189.23 53.34,189.23 | 53.34,189.23 41.91,200.66 38.1,200.66 36.83,201.93 36.83,203.43 FUELG.CKT3 | v53.34,186.69 53.34,189.23 | v46.99,191.77 48.26,193.04
  Top 1.27: v43.18,195.58 43.23,195.58 44.96,197.31 | DASH0.CKT2 14.07,171.27 16.18,169.16 17.86,169.16 17.88,169.14 17.86,169.14 | DASH0-1.2 24.97,168.91 23.95,167.89 22.15,167.89 20.88,169.16 20.85,169.14
  Route2 0.406: JP4.11 JP2.11 | JP3.2 JP1.2 | JP3.11 JP1.11 | JP4.2 JP2.2
  Route2 1.27: PAD1.1 PAD2.1
  Bottom 1.27: 19.3,212.34 DASH4.CKT4 | U$1.2
  pour Bottom: 0,111.76 116.84,111.76 116.84,0 0,0
  pour Bottom: 0,223.52 116.84,223.52 116.84,111.76 0,111.76
INV_ING_L
  Top 1.27: DAC0.CKT1 102.62,176.28 100.58,178.31 100.58,196.09 102.62,198.12 TS_L.CKT2
  Bottom 1.27: DAC.1 95.5,166.12 102.11,166.12 106.17,170.18 106.17,175.77 103.12,175.77 DAC0.CKT1 | TS.2 91.44,211.84 89.92,211.84 88.39,213.36 88.39,217.93 102.11,217.93 106.17,213.87 106.17,198.63 103.12,198.63 TS_L.CKT2
INV_ING_R  (via drill 0.51)
  Top 1.27: v96.52,205.23 95.5,205.23 94.49,204.22 94.49,203.71 93.98,203.2 93.98,202.18 91.44,202.18 TS.6 90.93,201.68 89.41,200.15 89.41,172.72 DAC.2
  Bottom 1.27: DAC.2 91.95,172.21 92.46,172.21 96.52,168.15 99.57,168.15 102.62,171.2 DAC0.CKT2 | v96.52,205.23 97.54,206.25 100.58,206.25 102.62,208.28 TS_R.CKT2
LAUNCH_LED  (via drill 0.51)
  Top 1.27: 39.12,7.62 JP1.5 39.12,8.13 39.12,9.14 37.59,10.67 37.59,27.94 v38.1,28.45 | 39.62,119.38 JP3.5 | 23.11,74.42 22.35,75.18 22.35,76.2 20.83,77.72 14.73,77.72 14.73,75.69 14.22,75.18 DO0.CKT2 | 23.11,74.42 24.89,72.64 25.4,72.64 DO.2 | DASH2-4.6 23.88,202.18 23.88,204.72 16.76,204.72 14.22,202.18 DASH3.CKT2 | v42.67,174.24 39.12,170.69 v39.12,170.18 | 23.11,74.42 22.35,73.66 v22.35,65.02
  Route2 0.406: JP3.5 JP1.5
  Bottom 1.27: DASH2-4.6 26.92,199.14 28.45,199.14 42.16,185.42 42.16,174.75 v42.67,174.24 | v39.12,170.18 39.12,119.38 JP3.5 | v22.35,65.02 35.05,52.32 36.58,52.32 38.1,50.8 v38.1,28.45
LAUNCH_SW  (via drill 0.51, 0.6)
  Top 1.27: v85.85,88.9 89.92,92.96 v89.92,93.47 | DI.2 83.82,66.04 v80.01,62.23
  Route2 0.406: JP3.6 JP1.6
  Bottom 0.406: JP3.6 JP1.6
  Bottom 1.27: DASH2-4.5 26.42,197.1 23.37,197.1 20.83,194.56 16.76,194.56 14.22,197.1 DASH3.CKT1 14.22,196.6 11.18,193.55 5.59,193.55 3.05,191.01 3.05,119.89 24.89,119.89 28.45,116.33 39.12,116.33 42.16,119.38 JP3.6 | DI.2 83.82,88.9 v85.85,88.9 | v89.92,93.47 85.85,97.54 85.34,97.54 DI0.CKT2 | JP1.6 45.72,11.43 46.99,11.43 80.01,44.45 v80.01,62.23
N$4
  Bottom 1.27: WHL_F.4 90.42,60.96 96.01,66.55 97.03,66.55 WHL_FL.CKT4
N$8  (via drill 0.51)
  Top 1.27: v92.46,65.53 93.98,64.01 93.98,58.93 97.03,55.88 WHL_FR.CKT4
  Bottom 1.27: v92.46,65.53 92.46,69.09 90.42,71.12 WHL_F.8
N$9  (via drill 0.51)
  Top 1.27: v92.46,32 93.98,30.48 93.98,25.91 97.03,22.86 WHL_RR.CKT4
  Bottom 1.27: WHL_R.8 92.46,38.1 94.49,36.07 94.49,34.54 | 95,34.54 94.49,34.54 | v92.46,32 94.49,34.04 94.49,34.54
N$12
  Bottom 1.27: IC3.3 33.02,24.38 33.53,24.89 34.04,24.89 35.56,26.42 35.56,27.43 36.07,27.94 36.07,50.29 33.53,50.29 33.02,49.78 IC4.1
N$13
  Bottom 1.27: WHL_R.4 91.44,27.94 96.52,33.02 97.03,33.02 WHL_RL.CKT4
N$14
  Bottom 1.27: U$1.3 25.4,37.59 25.4,42.67 29.46,42.67 30.99,44.2 33.02,44.2 IC4.3
N$22
  Bottom 1.27: 37.59,18.29 37.59,25.4 38.61,26.42 40.64,26.42 IC3.7 | 37.59,18.29 40.13,18.29 R3.P$1 | R4.P$2 39.12,15.24 37.59,16.76 37.59,18.29
N$23  (via drill 0.51)
  Top 1.27: v45.21,24.38 47.24,24.38 47.24,17.78 46.23,16.76 v45.72,16.76
  Bottom 1.27: IC3.2 33.02,26.92 32.51,26.42 28.96,26.42 24.89,22.35 24.89,18.8 27.94,18.8 C3.1 27.94,18.29 28.45,18.29 31.5,15.24 R4.P$1 33.53,15.24 35.56,13.21 42.16,13.21 v45.72,16.76 | v45.21,24.38 40.64,24.38 IC3.6
N$24  (via drill 0.51)
  Top 1.27: v43.18,26.42 43.18,23.88 41.15,21.84 40.64,21.84 IC3.5
  Bottom 1.27: v43.18,26.42 43.18,30.48 C4.1
N$30
  Route2 0.406: JP2.4 JP4.4
N$31
  Route2 0.406: JP4.5 JP2.5
N$32
  Route2 0.406: JP2.6 JP4.6
N$33
  Route2 0.406: JP4.7 JP2.7
N$34  (via drill 0.51)
  Top 1.27: v52.32,88.39 52.32,91.95 51.82,92.46 51.82,92.96 v49.78,95
  Bottom 1.27: v52.32,88.39 52.32,85.34 ADC.5 | v49.78,95 49.28,95.5 47.24,95.5 45.21,97.54 ADC1.CKT1
N$35
  Bottom 1.27: ADC.6 49.78,85.34 49.78,89.41 50.8,89.41 52.32,90.93 52.32,95 49.78,97.54 ADC1.CKT2
N$36
  Bottom 1.27: ADC.7 47.24,85.34 47.24,89.92 46.74,89.92 44.7,91.95 ADC1.CKT3
N$37
  Top 1.27: ADC.8 46.23,86.87 46.23,87.88 49.28,90.93 49.28,91.95 ADC1.CKT4
N$38
  Bottom 1.27: ADC.9 42.16,84.84 42.16,82.3 33.02,82.3 31.5,83.82 31.5,97.54 34.54,97.54 ADC2.CKT1
N$39
  Bottom 1.27: ADC.10 39.62,85.34 39.62,89.41 40.64,89.41 42.16,90.93 42.16,97.54 39.62,97.54 ADC2.CKT2
N$42
  Route2 0.406: JP4.8 JP2.8
N$48  (1 unrouted)
  Top 1.016: 95.38,210.54 99.19,210.54
  Top 1.27: TS.1 92.08,214.63 93.98,212.72 93.98,212.09 95.38,210.54 | 99.19,210.54 100.33,209.55 100.33,205.13 TS_L.CKT1
  Bottom 1.27: ADC.11 37.08,85.34 37.08,89.92 36.58,89.92 34.54,91.95 ADC2.CKT3
N$49  (via drill 0.51)  (1 unrouted)
  Top 1.27: ADC.12 36.07,86.87 36.07,87.88 39.12,90.93 39.12,91.95 ADC2.CKT4 | v93.98,207.77 93.98,206.76 91.95,204.72 91.44,204.72 TS.5
  Bottom 1.27: v93.98,207.77 93.98,215.9 99.57,215.9 102.62,212.85 TS_R.CKT1
N$52
  Bottom 1.27: DAC.3 92.96,175.26 93.98,176.28 97.03,176.28 DAC0.CKT3
N$53  (via drill 0.51)
  Top 1.27: DAC.4 94.49,174.75 v94.49,174.24
  Bottom 1.27: v94.49,174.24 97.03,171.7 DAC0.CKT4
N$54
  Bottom 1.27: DAC.5 89.92,180.34 87.88,182.37 87.88,191.01 98.04,191.01 102.62,186.44 DAC1.CKT1
N$55
  Bottom 1.27: DAC.6 92.96,182.88 96.52,179.32 100.58,179.32 102.62,181.36 DAC1.CKT2
N$56
  Bottom 1.27: DAC.7 92.96,185.42 93.98,186.44 97.03,186.44 DAC1.CKT3
N$57
  Bottom 1.27: DAC.8 91.95,188.47 98.04,188.47 100.08,186.44 100.08,181.86 97.54,181.86 DAC1.CKT4
N$65  (via drill 0.51)
  Top 1.27: v24.38,142.75 19.81,147.32 DIPU1.CKT4
  Bottom 1.27: v24.38,142.75 25.91,142.75 26.42,142.24 DIPU.8
N$66
  Bottom 1.27: DIPU.9 27.94,139.7 29.46,138.18 29.46,129.03 17.78,129.03 14.22,132.59 DIPU2.CKT1
N$67
  Bottom 1.27: DIPU.10 23.88,137.16 21.34,139.7 16.76,139.7 14.22,137.16 DIPU2.CKT2
N$68
  Bottom 1.27: DIPU.11 21.84,134.62 20.32,133.1 19.81,133.1 DIPU2.CKT3
N$69  (via drill 0.51)
  Top 1.27: v24.38,132.59 19.81,137.16 DIPU2.CKT4
  Bottom 1.27: v24.38,132.59 25.91,132.59 26.42,132.08 DIPU.12
N$76
  Bottom 1.27: DI.7 71.12,92.46 70.61,92.46 DI1.CKT3
N$77
  Bottom 1.27: DI.8 68.58,90.93 68.07,91.44 68.07,93.98 69.09,93.98 70.1,95 72.14,95 74.68,92.46 DI1.CKT4
N$84
  Bottom 1.27: DO.7 25.4,84.84 23.37,84.84 19.3,80.77 DO1.CKT3
N$85
  Bottom 1.27: DO.8 25.4,87.88 22.35,87.88 19.81,85.34 DO1.CKT4
PADDLE_DN
  Route2 0.406: JP3.9 JP1.9
  Bottom 1.27: DASH3.CKT4 19.81,202.18 21.84,202.18 24.38,204.72 26.42,204.72 DASH2-4.8 26.92,204.22 28.45,204.22 49.28,183.39 49.28,119.38 JP3.9 | SHFT.CKT2 14.22,16.26 16.26,14.22 16.26,10.67 22.35,4.57 46.74,4.57 49.78,7.62 JP1.9
PADDLE_UP  (via drill 0.51)
  Top 1.27: v51.31,165.61 v47.24,169.67
  Route2 0.406: JP1.10 JP3.10
  Bottom 1.27: DASH3.CKT3 19.81,197.61 20.83,197.61 24.89,201.68 26.42,201.68 DASH2-4.7 26.92,201.68 28.45,201.68 47.24,182.88 v47.24,169.67 | SHFT.CKT1 14.22,11.68 14.22,2.54 47.24,2.54 52.32,7.62 JP1.10 | v51.31,165.61 51.31,121.41 52.07,120.65 JP3.10
PB_AC
  Bottom 1.27: 62.99,97.54 62.99,91.44 60.96,89.41 59.94,89.41 59.94,85.34 ADC.2 | 62.99,97.54 59.94,97.54 ADC0.CKT2 | PB_AC.CKT2 102.62,96.52 100.08,93.98 93.47,93.98 86.36,101.09 67.06,101.09 63.5,97.54 62.99,97.54
PB_BK  (via drill 0.51)
  Top 1.27: v108.2,91.44 103.63,86.87 103.12,86.87 PB_BK.CKT2
  Bottom 1.27: ADC.3 57.4,85.34 57.4,89.92 56.9,89.92 54.86,91.95 ADC0.CKT3 55.37,92.96 55.37,94.49 52.83,97.03 52.83,98.55 54.86,100.58 57.91,100.58 66.04,108.71 99.57,108.71 106.17,102.11 106.17,101.6 113.28,101.6 113.28,96.52 v108.2,91.44
RTD_SIG
  Bottom 1.27: DO.4 25.4,77.22 23.37,77.22 21.34,75.18 19.81,75.18 DO0.CKT4 18.8,74.68 18.29,74.68 15.75,77.22 10.67,77.22 10.67,35.05 12.19,33.53 12.7,33.53 13.72,32.51 RTD.CKT1
SERIAL_K  (via drill 0.51)
  Top 1.27: ABOX.11 80.77,196.09 v80.77,192.02 | v10.67,198.12 10.16,198.12 v10.16,191.52
  Bottom 1.27: DASH0-1.3 26.42,171.7 23.88,171.7 23.5,172.09 | DASH0.CKT3 19.81,167.13 19.81,168.4 23.5,172.09 | 49.78,212.85 49.78,195.07 56.9,187.96 73.15,187.96 75.18,189.99 80.77,189.99 v80.77,192.02 | 49.78,212.85 60.96,212.85 62.99,210.82 62.99,205.74 64.52,204.22 65.02,204.22 ABOX2.CKT3 | 23.5,172.09 20.83,174.75 18.8,174.75 16.26,177.29 16.26,182.37 13.72,184.91 11.68,184.91 10.67,185.93 10.67,191.52 v10.16,191.52 | 49.78,212.85 38.61,212.85 34.04,217.42 10.67,217.42 10.67,198.63 10.41,198.37 v10.67,198.12
SERIAL_L  (via drill 0.51, 0.6)
  Top 1.27: DASH0-1.4 24.89,172.21 23.88,172.21 23.88,170.56 v23.47,169.54 | ABOX.12 84.33,195.07 84.33,193.04 81.28,189.99 78.74,189.99 v78.74,192.02 | v76.2,198.63 72.64,202.18 v72.64,203.71 | v16.26,164.59 15.24,163.58 3.05,163.58 v3.05,193.55
  Bottom 1.27: 17.53,165.86 16.26,167.13 16.26,169.16 16.76,169.16 18.8,171.2 19.3,171.2 DASH0.CKT4 | 17.53,165.86 19.3,164.08 23.11,164.08 23.5,164.47 v23.47,169.54 | v78.74,192.02 57.91,192.02 55.88,194.06 53.34,194.06 51.82,195.58 51.82,199.64 56.39,199.64 | 72.14,204.22 72.14,210.31 70.1,212.34 67.06,212.34 58.93,220.47 17.27,220.47 15.75,222 3.05,222 v3.05,193.55 | 72.14,204.22 70.1,204.22 ABOX2.CKT4 | ABOX.12 80.77,198.63 v76.2,198.63 | v72.64,203.71 72.14,203.71 72.14,204.22 | v16.26,164.59 17.53,165.86
ST_ANG  (via drill 0.51)
  Top 1.27: v55.37,87.88 59.44,91.95 ADC0.CKT4 | 102.62,76.2 ST_ANG.CKT2 100.23,73.66 v92.96,73.66 | v80.77,76.2 v76.71,80.26
  Bottom 1.27: v92.96,73.66 90.93,75.69 80.77,75.69 v80.77,76.2 | v76.71,80.26 58.93,80.26 54.36,84.84 ADC.4 54.86,85.34 55.37,85.34 v55.37,87.88
SW_1  (via drill 0.51)
  Top 1.27: v23.88,174.24 16.76,174.24 14.22,176.78 DASH1.CKT1
  Bottom 1.27: DIPU0.CKT1 16.26,155.45 16.26,159.51 | 16.26,159.51 20.83,159.51 21.34,160.02 DIPU.1 26.92,160.02 29.46,162.56 29.46,176.28 26.92,176.28 DASH0-1.5 26.42,176.28 25.91,176.28 v23.88,174.24 | 16.26,159.51 13.21,162.56
SW_2  (via drill 0.51)
  Top 1.27: v23.88,162.05 23.88,159.51 24.38,159 24.89,159 26.42,157.48 DIPU.2
  Bottom 1.27: DIPU.2 27.94,157.48 31.5,161.04 31.5,178.82 26.92,178.82 DASH0-1.6 | DIPU0.CKT2 11.33,160.25 11.3,164.64 | 11.3,164.64 11.3,181.41 13.72,181.36 DASH1.CKT2 | 24.89,162.05 v23.88,162.05 20.83,162.05 20.32,161.54 16.76,161.54 13.72,164.59 11.3,164.64
SW_3  (via drill 0.51)
  Top 1.27: v22.86,152.4 22.86,154.94 DIPU.3 29.97,154.94 29.97,157.48 29.46,157.99 29.46,180.34 v28.96,180.85
  Bottom 1.27: DASH1.CKT3 19.81,177.29 20.83,177.29 24.89,181.36 26.42,181.36 DASH0-1.7 26.92,181.36 28.45,181.36 v28.96,180.85 | v22.86,152.4 22.35,152.91 19.81,152.91 DIPU0.CKT3
SW_MODE0  (via drill 0.51)
  Top 1.27: v31.5,158.5 36.07,163.07 v36.07,179.83
  Bottom 1.27: DIPU0.CKT4 19.81,156.97 20.83,156.97 25.4,152.4 DIPU.4 26.92,152.91 28.45,152.91 31.5,155.96 v31.5,158.5 | DASH2.CKT1 14.22,186.94 16.76,184.4 22.86,184.4 24.89,186.44 26.42,186.44 DASH2-4.1 26.92,186.44 29.46,186.44 v36.07,179.83
SW_MODE1  (via drill 0.51)
  Top 1.27: DASH2-4.2 24.89,191.01 24.38,191.01 20.83,194.56 16.76,194.56 v16.76,192.53 | DIPU.5 29.46,149.86 v29.46,146.3 | DASH2.CKT2 13.72,191.52 12.19,189.99 11.68,189.99 10.16,188.47 10.16,184.15 v9.91,183.9
  Bottom 1.27: 21.84,186.44 22.35,186.44 24.89,188.98 26.42,188.98 DASH2-4.2 | v16.76,192.53 16.26,192.02 14.22,192.02 DASH2.CKT2 | v29.46,146.3 29.46,140.72 31.5,138.68 31.5,127 16.26,127 11.68,131.57 11.68,142.75 | 11.68,142.75 13.72,142.75 DIPU1.CKT1 | 11.68,142.75 11.68,156.29 9.53,158.85 9.53,182.65 v9.91,183.9
TRACTL_LED  (via drill 0.51)
  Top 1.27: 44.7,7.62 JP1.7 44.7,8.13 45.21,8.64 45.21,9.65 49.28,13.72 v49.28,20.32 | v40.13,176.78 38.1,174.75 v38.1,173.74
  Route2 0.406: JP3.7 JP1.7
  Bottom 1.27: 23.62,67.82 22.86,67.06 17.27,67.06 14.22,70.1 DO0.CKT1 | 23.62,67.82 25.4,69.6 DO.1 | DASH2.CKT4 19.81,192.02 21.34,192.02 23.88,194.56 26.42,194.56 DASH2-4.4 26.92,194.56 28.96,194.56 40.13,183.39 v40.13,176.78 | v38.1,173.74 44.2,167.64 44.2,119.38 JP3.7 | 23.62,67.82 39.12,52.32 41.66,52.32 47.24,46.74 47.24,20.32 | 47.24,18.29 47.24,20.32 | 47.24,20.32 v49.28,20.32
TRACTL_POT  (via drill 0.51)
  Top 1.27: 64.01,86.87 ADC.1 | 64.01,86.87 64.01,92.46 v60.96,95.5 | v65.02,78.23 65.02,86.36 64.52,86.87 64.01,86.87
  Route2 0.406: JP1.4 JP3.4
  Bottom 1.27: DASH1.CKT4 19.81,181.86 22.86,181.86 24.89,183.9 26.42,183.9 DASH0-1.8 26.92,183.9 28.45,183.9 31.5,180.85 32.51,180.85 36.07,177.29 36.07,120.4 37.08,119.38 JP3.4 | JP1.4 36.58,7.62 39.62,10.67 42.16,10.67 65.02,33.53 v65.02,78.23 | v60.96,95.5 57.4,95.5 55.37,97.54 ADC0.CKT1
TRACTL_SW  (via drill 0.51)
  Top 1.27: v90.42,89.41 86.36,85.34 DI.1 86.87,84.84 86.87,83.31 85.85,82.3 85.85,64.01 85.34,63.5 v85.34,47.75
  Route2 0.406: JP1.8 JP3.8
  Bottom 1.27: DI0.CKT1 80.26,97.54 82.3,95.5 85.34,95.5 89.92,90.93 89.92,90.42 90.42,90.42 v90.42,89.41 | DASH2.CKT3 19.81,187.45 24.38,192.02 26.42,192.02 DASH2-4.3 26.92,191.52 28.45,191.52 38.1,181.86 38.1,175.77 38.61,175.77 46.74,167.64 46.74,119.38 JP3.8 | 86.61,46.99 49.28,9.65 48.77,9.65 46.74,7.62 JP1.8 | 86.61,46.99 86.87,47.24 | v85.34,47.75 85.85,47.24 86.36,47.24 86.61,46.99
TSAL_OUTPUT
  Bottom 1.27: U$1.1 27.43,45.72 25.91,45.72 22.86,42.67 22.86,19.3 16.76,19.3 14.22,21.84 TSAL.CKT1
TSMP_ISO
  Bottom 1.27: IC4.2 33.02,47.24 29.46,47.24 28.96,47.75 21.84,47.75 21.34,47.24 19.81,47.24 TSMP.CKT4
VBATT_FUSED  (via drill 0.6)
  Top 1.27: R3.P$2 34.29,17.78 35.56,16.51 35.56,12.7 33.02,10.16 27.94,10.16 26.67,8.89 26.67,6.35 27.94,5.08 54.61,5.08 JP1.12 | ABOX.1 50.8,200.66 50.8,208.28 52.07,209.55 55.22,209.55 ABOX0.CKT1 | DASH0.CKT1 16.13,167.06 17.25,165.94 17.3,165.94 19.07,164.16 24.46,164.16 DASH0-1.1
  Route2 0.406: JP4.12 JP2.12 | JP4.1 JP2.1 | JP3.1 JP1.1 | JP1.12 JP3.12
  Bottom 1.27: 44.73,193.42 44.73,194.51 47.37,197.16 47.37,198.63 | 47.37,198.63 47.47,198.73 | 60.12,189.79 57.61,189.79 56.16,191.24 56.06,191.24 55.32,191.97 | 55.32,191.97 55.07,192.23 | 55.32,191.97 55.37,192.02 v54.94,192.25 | v47.47,198.7 47.75,198.63 47.37,198.63
  other vias: 44.68,193.4 60.17,189.79 5.87,165.71 7.37,165.74 5.82,161.54 7.32,161.57
  pour Top: 0,223.52 116.84,223.52 116.84,111.76 0,111.76
  pour Top: 0,111.76 116.84,111.76 116.84,0 0,0
  pour Bottom: 5.31,166.65 7.95,166.65 8.31,166.29 8.31,161.09 7.92,160.71 5.28,160.71 4.85,161.14 4.85,166.19
VSENS  (via drill 0.51)
  Top 1.27: WHL_R.5 87.38,30.48 87.38,21.34 88.9,19.81 89.92,19.81 89.92,20.32 WHL_R.1 | v93.98,48.26 93.98,49.78 90.42,53.34 WHL_F.1 89.92,52.83 88.9,52.83 87.38,54.36 87.38,62.99 87.88,63.5 WHL_F.5 | ABOX.4 62.23,186.69 60.96,185.42 59.69,185.42 57.15,182.88 57.15,168.15 | 57.15,168.15 57.15,128.27 59.69,125.73 62.23,125.73 64.77,123.19 JP4.3 65.02,118.87 64.69,118.87 | JP2.3 64.77,6.35 66.04,5.08 80.01,5.08 JP2.10 | 64.69,119.25 64.69,118.87 | 64.69,118.87 64.69,118.19 66.04,116.84 81.23,116.84 82.47,118.08 82.47,119.38 | FUEL_R.2 51.31,213.87 62.48,213.87 62.48,215.9 66.55,219.96 105.66,219.96 105.66,170.69 103.12,168.15 57.15,168.15
  Route2 0.406: JP4.10 JP2.10 | JP2.3 JP4.3
  Bottom 1.27: 106.17,70.1 106.17,63.5 WHL_FR.CKT1 103.12,59.94 105.16,57.91 105.16,48.26 94.49,48.26 94.23,48.01 | 106.17,70.1 103.12,70.1 WHL_FL.CKT1 | 104.9,78.49 106.17,77.22 106.17,70.1 | 104.9,78.49 103.12,80.26 ST_ANG.CKT1 | 104.9,88.65 106.17,87.38 106.17,78.74 105.16,78.74 104.9,78.49 | 104.9,88.65 103.12,90.42 PB_BK.CKT1 | PB_AC.CKT1 103.12,100.58 106.17,97.54 106.17,88.9 105.16,88.9 104.9,88.65 | 92.96,19.81 97.54,19.81 100.58,22.86 100.58,26.92 102.62,26.92 WHL_RR.CKT1 | 92.96,19.81 90.93,19.81 90.42,20.32 WHL_R.1 | 92.96,20.83 92.96,19.81 | 94.23,48.01 102.62,39.62 102.62,37.59 WHL_RL.CKT1 103.12,37.08 106.68,37.08 106.68,30.99 WHL_RR.CKT1 | 94.23,48.01 v93.98,48.26 | ABOX.4 62.48,197.1 62.48,203.71 59.94,203.71 ABOX0.CKT4 | JP2.10 82.55,6.35 83.82,5.08 88.9,5.08 90.17,6.35 90.17,13.97 91.44,15.24 99.06,15.24 105.41,21.59 105.41,24.79 WHL_RR.CKT1
VSENS_UNFUSED
  Bottom 1.27: ABOX.3 59.94,197.1 59.94,200.66 57.91,200.66 54.86,203.71 ABOX0.CKT3
WHL_FL  (via drill 0.51)
  Top 1.27: v81.28,80.26 DI.3
  Bottom 1.27: DI.3 81.28,92.46 80.77,92.46 DI0.CKT3 | WHL_F.2 92.46,55.88 93.98,57.4 93.98,61.47 96.01,63.5 100.08,63.5 101.35,64.77 | 101.35,64.77 102.62,66.04 WHL_FL.CKT2 | v81.28,80.26 83.82,77.72 91.44,77.72 95.5,73.66 99.06,73.66 100.58,72.14 100.58,65.02 101.09,65.02 101.35,64.77
WHL_FR
  Bottom 1.27: 87.88,66.04 WHL_F.6 | 87.88,66.04 78.74,75.18 78.74,82.3 | DI.4 78.74,82.3 | WHL_FR.CKT2 102.62,55.88 97.03,50.29 88.9,50.29 87.38,51.82 87.38,66.04 87.88,66.04 | 78.74,82.3 89.41,82.3 89.41,87.88 85.34,91.95 DI0.CKT4
WHL_RL  (via drill 0.51)
  Top 1.27: v71.63,78.23 v71.63,82.3
  Bottom 1.27: DI.5 76.2,82.3 v71.63,82.3 67.56,82.3 65.53,84.33 65.53,96.01 68.07,96.01 69.6,97.54 70.1,97.54 DI1.CKT1 | WHL_R.2 92.46,22.86 93.98,24.38 93.98,26.92 97.54,30.48 100.08,30.48 101.35,31.75 | 101.35,31.75 102.62,33.02 WHL_RL.CKT2 | 101.35,31.75 101.09,32 100.58,32 100.58,39.12 99.06,40.64 96.01,40.64 86.87,49.78 85.34,49.78 85.34,60.96 71.63,74.68 v71.63,78.23
WHL_RR  (via drill 0.51)
  Top 1.27: DI.6 73.66,56.9 v86.36,44.2
  Bottom 1.27: DI.6 73.66,88.9 75.69,88.9 77.72,90.93 77.72,97.54 75.18,97.54 DI1.CKT2 | WHL_R.6 88.9,33.02 88.14,32.26 | 88.14,32.26 87.38,31.5 87.38,17.27 98.55,17.27 102.62,21.34 102.62,22.86 WHL_RR.CKT2 | 88.14,32.26 85.34,35.05 85.34,35.56 86.36,35.56 v86.36,44.2

### Text on the board
tPlace: RUN GND WIRE | MHybrid / Control Unit Rev0.1 / Brian Margosian '15 | MHybrid / Control Unit Rev0.1 / Brian Margosian '15